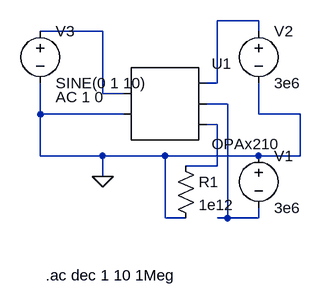
[diagram p0: schematic Draft1.asc]
Draft1.asc, the LTspice schematic file:
Version 4
SHEET 1 880 680
WIRE 432 192 368 192
WIRE 192 208 96 208
WIRE 432 208 432 192
WIRE 368 288 368 192
WIRE 368 288 352 288
WIRE 192 304 192 208
WIRE 224 304 192 304
WIRE 384 320 352 320
WIRE 96 336 96 288
WIRE 224 336 96 336
WIRE 432 336 432 288
WIRE 496 336 432 336
WIRE 368 352 352 352
WIRE 96 400 96 336
WIRE 192 400 96 400
WIRE 288 400 192 400
WIRE 432 400 288 400
WIRE 496 400 496 336
WIRE 496 400 432 400
WIRE 368 416 368 352
WIRE 368 416 320 416
WIRE 192 432 192 400
WIRE 288 496 288 400
WIRE 320 496 288 496
WIRE 384 496 384 320
WIRE 384 496 368 496
WIRE 432 496 432 480
WIRE 432 496 384 496
FLAG 192 432 0
SYMBOL AutoGenerated/OPAx210 288 320 R0
SYMATTR InstName U1
SYMBOL voltage 432 384 R0
SYMATTR InstName V1
SYMATTR Value 3e6
SYMBOL voltage 432 192 R0
SYMATTR InstName V2
SYMATTR Value 3e6
SYMBOL voltage 96 192 R0
WINDOW 123 24 118 Left 2
SYMATTR Value2 AC 1 0
SYMATTR InstName V3
SYMATTR Value SINE(0 1 10)
SYMBOL res 304 400 R0
SYMATTR InstName R1
SYMATTR Value 1e12
TEXT 104 584 Left 2 !.ac dec 1 10 1Meg

The netlist it stands for:
* Draft1.asc
* U1: OPAx210 (symbol AutoGenerated/OPAx210 not available, pins judged from their places): pin1=N002 pin2=0 pin3=N001 pin4=N003 pin5=N004
V1 0 N003 3e6
V2 N001 0 3e6
V3 N002 0 SINE(0 1 10) AC 1 0
R1 N004 0 1e12
.ac dec 1 10 1Meg
.backanno
.end